# Altium schematic sheet Sheet2.SchDoc
size A3; SheetNumber: 1; SheetTotal: 1
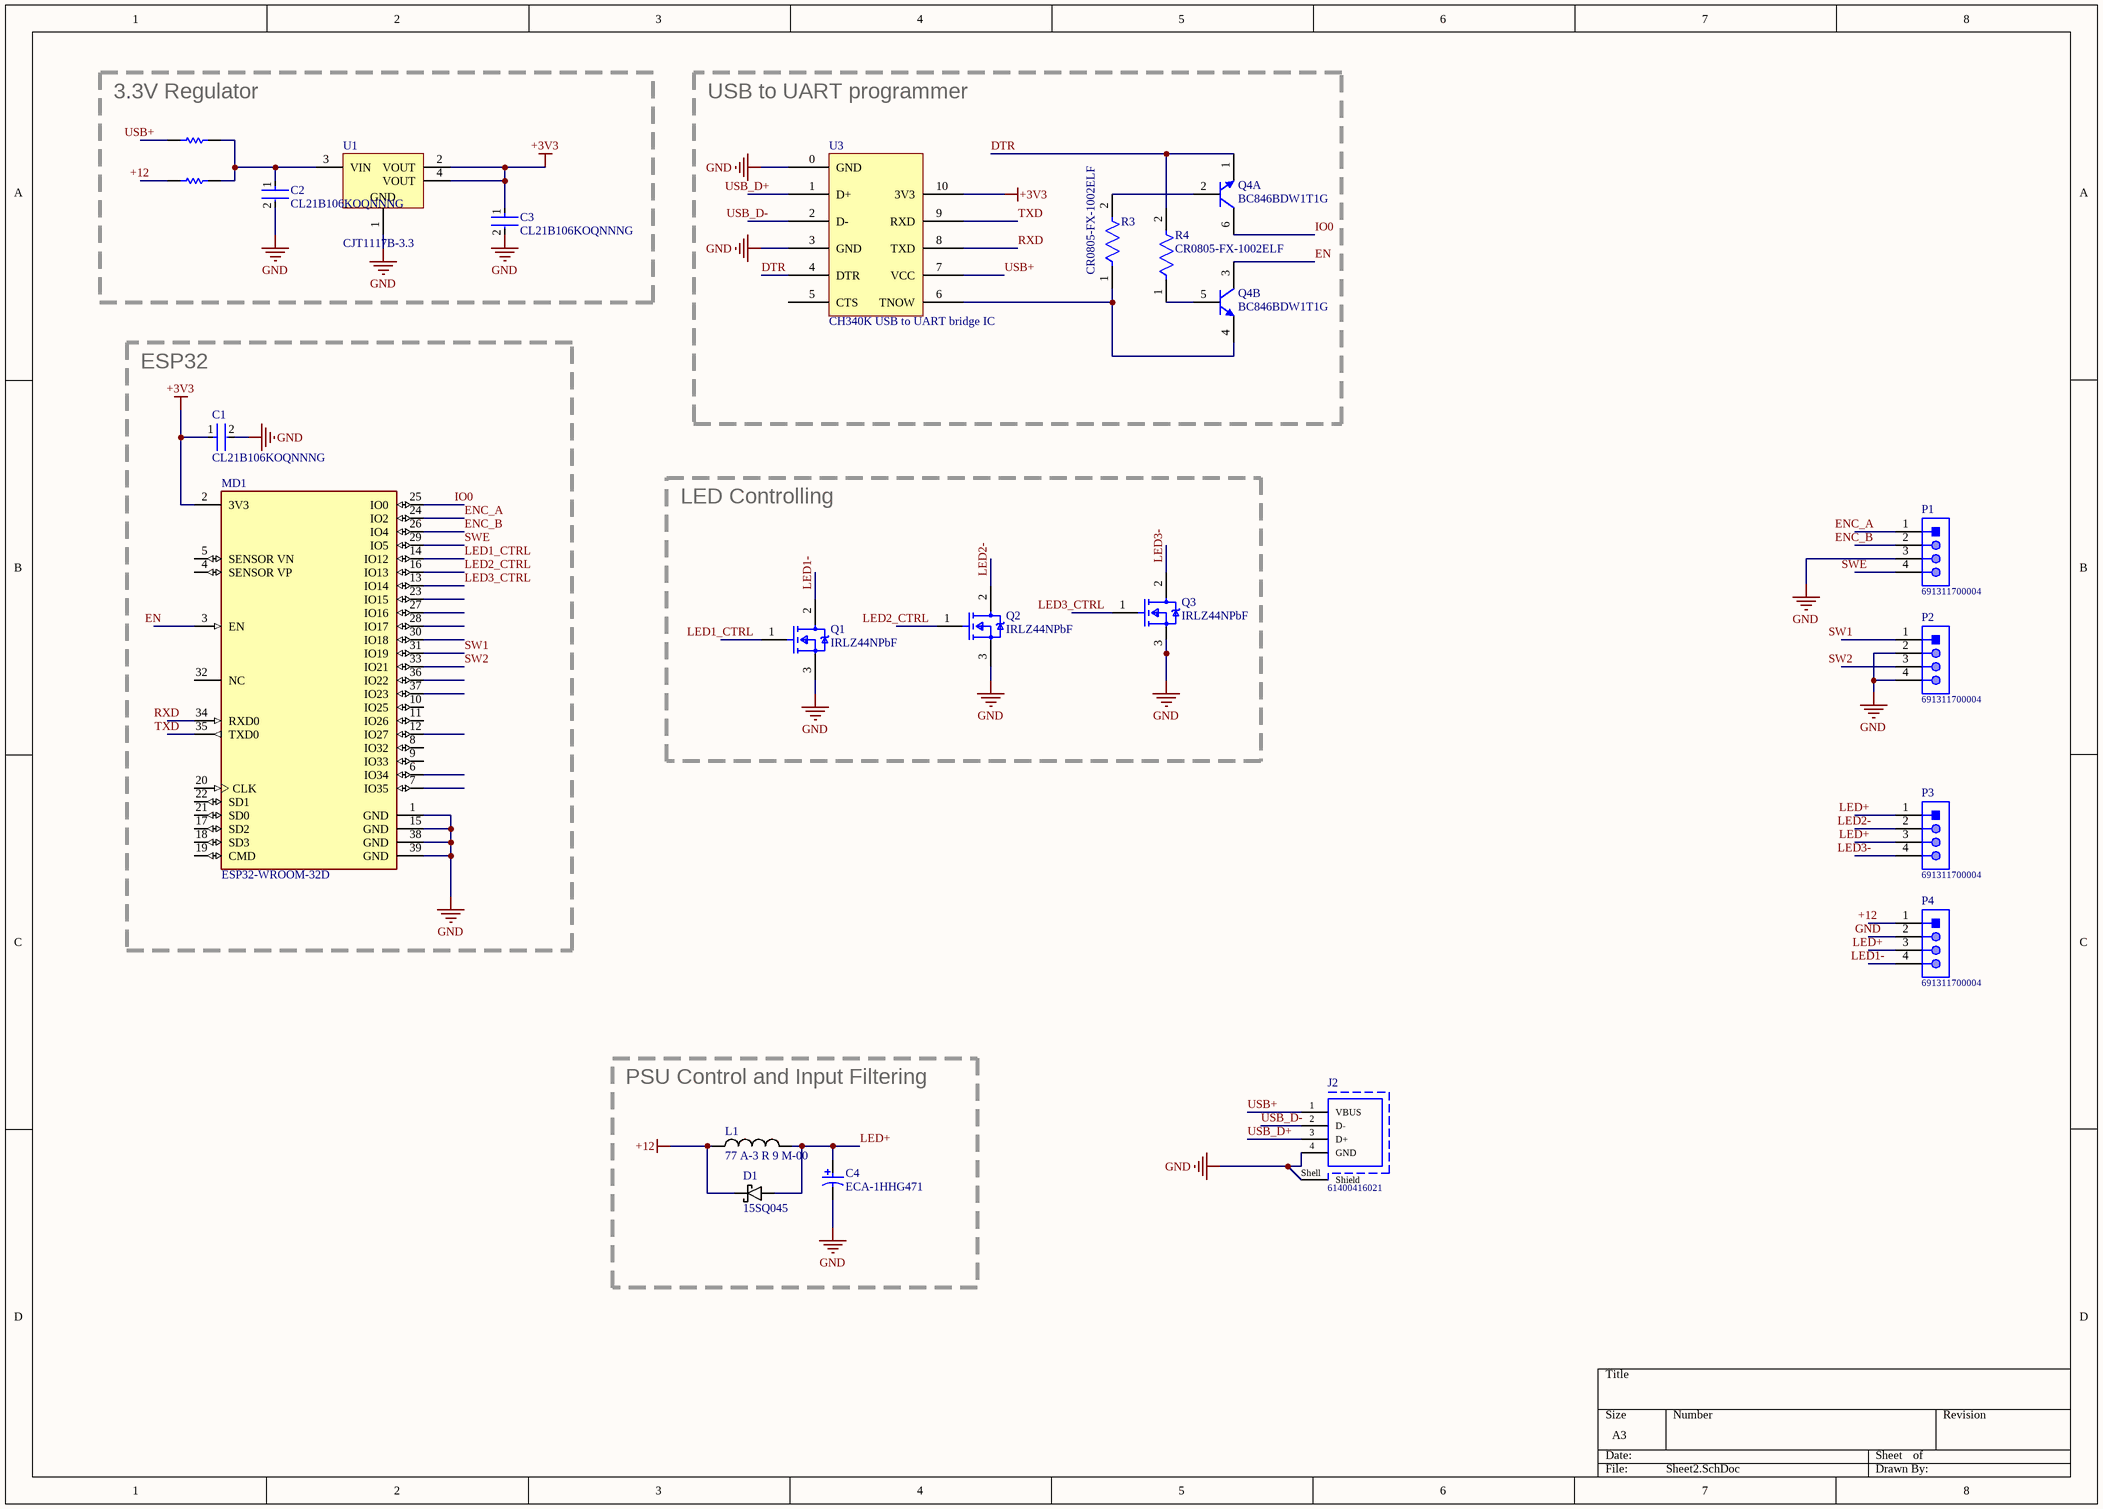
[diagram p0: Sheet2.SchDoc]

## Parts
C1  CL21B106KOQNNNG  [FP-CL21B106KOQNNNG-MFG]
C2  CL21B106KOQNNNG  [FP-CL21B106KOQNNNG-MFG]
C3  CL21B106KOQNNNG  [FP-CL21B106KOQNNNG-MFG]
C4  ECA-1HHG471  [PNSC-CAP-10x20-P2]
D1  15SQ045  [Shottky Diode]
J2  61400416021  [61400416021]
L1  77 A-3 R 9 M-00  [FIlter Inductor]
MD1  ESP32-WROOM-32D  [FP-ESP32-WROOM-32D-MFG]
P1  691311700004  [691311700004]
P2  691311700004  [691311700004]
P3  691311700004  [691311700004]
P4  691311700004  [691311700004]
Q1  IRLZ44NPbF  [FP-PG-TO220-3-MFG]
Q2  IRLZ44NPbF  [FP-PG-TO220-3-MFG]
Q3  IRLZ44NPbF  [FP-PG-TO220-3-MFG]
Q4  BC846BDW1T1G  [ONSC-SOT-363-6-419B-02_W_V]  (parts A,B of 2)
R1  RC0603JR-070RL  [RESC1608X55X25ML10T15]  (value not drawn)  (no BOM)
R2  RC0603JR-070RL  [RESC1608X55X25ML10T15]  (value not drawn)  (no BOM)
R3  CR0805-FX-1002ELF  [FP-CR0805-IPC_A]
R4  CR0805-FX-1002ELF  [FP-CR0805-IPC_A]
U1  CJT1117B-3.3  [DCY0004A_L]
U3  CH340K USB to UART bridge IC  [CH340K footprint]

## Blocks framed on the sheet
3.3V Regulator: C2 C3 R1 R2 U1
USB to UART programmer: Q4 R3 R4 U3
ESP32: C1 MD1
LED Controlling: Q1-Q3
PSU Control and Input Filtering: C4 D1 L1

## Nets
+3V3: C1.1 C3.1 MD1.2(3V3) U1.2(VOUT) U1.4(VOUT) U3.10(3V3)
+12: D1.2 L1.1 P4.1 R2.1
GND: C1.2 C2.2 C3.2 C4.2 J2.4(GND) J2.Shell(Shield) MD1.1(GND) MD1.15(GND) MD1.38(GND) MD1.39(GND) P1.3 P2.2 P2.4 P4.2 Q1.3(S) Q2.3(S) Q3.3(S) U1.1(GND) U3.0(GND) U3.3(GND)
DTR: Q4.1(E) R4.2 U3.4(DTR)
EN: MD1.3(EN) Q4.3(C)
ENC_A: MD1.24(IO2) P1.1
ENC_B: MD1.26(IO4) P1.2
IO0: MD1.25(IO0) Q4.6(C)
LED1-: P4.4 Q1.2(D)
LED1_CTRL: MD1.14(IO12) Q1.1(G)
LED2-: P3.2 Q2.2(D)
LED2_CTRL: MD1.16(IO13) Q2.1(G)
LED3-: P3.4 Q3.2(D)
LED3_CTRL: MD1.13(IO14) Q3.1(G)
LED+: C4.1 D1.1 L1.2 P3.1 P3.3 P4.3
RXD: MD1.34(RXD0) U3.8(TXD)
SW1: MD1.31(IO19) P2.1
SW2: MD1.33(IO21) P2.3
SWE: MD1.29(IO5) P1.4
TXD: MD1.35(TXD0) U3.9(RXD)
USB+: J2.1(VBUS) R1.1 U3.7(VCC)
USB_D+: J2.3(D+) U3.1(D+)
USB_D-: J2.2(D-) U3.2(D-)
NetC2_1: C2.1 R1.2 R2.2 U1.3(VIN)
NetQ4_2: Q4.2(B) R3.2
NetQ4_4: Q4.4(E) R3.1 U3.6(TNOW)
NetQ4_5: Q4.5(B) R4.1

Not connected (* = marked no-connect by the designer): MD1 4(SENSOR_VP) 5(SENSOR_VN) 6(IO34) 7(IO35) 8(IO32) 9(IO33) 10(IO25) 11(IO26) 12(IO27) 17(SD2) 18(SD3) 19(CMD) 20(CLK) 21(SD0) 22(SD1) 23(IO15) 27(IO16) 28(IO17) 30(IO18) 32(NC) 36(IO22) 37(IO23); U3 5(CTS)

## Library data of the parts
C1 = CMP-13271-000015-1: CAP CER 10UF 16V X7R 0805; Manufacturer: Samsung Electro-Mechanics; Temperature Coefficient: 15%; Tolerance: 10%; Capacitance: 100nF; Material: Ceramic; ComponentLink2URL: http://product.samsungsem.com/mlcc/CL21B106KOQNNN.do; Package: 0; Voltage Rating: 16V; Value: 10uF; Height: 1.4mm; Temperature Characteristic: X7R; Manufacturer Part Number: CL21B106KOQNNNG; Category: Cap; Lead Free: Yes; RoHS: TRUE; ComponentLink2Description: Datasheet; Octopart: https://octopart.com/cl21b106koqnnng-samsung-19995691; Device Class L1: Passive Components; Temperature Range Low: -55°C; Device Class L3: Ceramic Capacitors; Ipc Land Pattern Name: CAPC200125X125; Digikey Description: CAP CER 10UF 16V X7R 0805; Automotive: No; Temperature Range High: +125°C; Device Class L2: Capacitors; Temperature: -55°C to +125°C
C2 = CMP-13271-000015-1: CAP CER 10UF 16V X7R 0805; Manufacturer: Samsung Electro-Mechanics; Temperature Coefficient: 15%; Tolerance: 10%; Material: Ceramic; ComponentLink2URL: http://product.samsungsem.com/mlcc/CL21B106KOQNNN.do; Package: 0; Voltage Rating: 16V; Value: 10uF; Height: 1.4mm; Temperature Characteristic: X7R; Manufacturer Part Number: CL21B106KOQNNNG; Category: Cap; Lead Free: Yes; RoHS: TRUE; ComponentLink2Description: Datasheet; Octopart: https://octopart.com/cl21b106koqnnng-samsung-19995691; Device Class L1: Passive Components; Temperature Range Low: -55°C; Device Class L3: Ceramic Capacitors; Ipc Land Pattern Name: CAPC200125X125; Digikey Description: CAP CER 10UF 16V X7R 0805; Automotive: No; Capacitance: 10uF; Temperature Range High: +125°C; Device Class L2: Capacitors; Temperature: -55°C to +125°C
C3 = CMP-13271-000015-1: CAP CER 10UF 16V X7R 0805; Manufacturer: Samsung Electro-Mechanics; Temperature Coefficient: 15%; Value: 22uF; Tolerance: 10%; Material: Ceramic; ComponentLink2URL: http://product.samsungsem.com/mlcc/CL21B106KOQNNN.do; Package: 0; Voltage Rating: 16V; Height: 1.4mm; Temperature Characteristic: X7R; Manufacturer Part Number: CL21B106KOQNNNG; Category: Cap; Lead Free: Yes; RoHS: TRUE; ComponentLink2Description: Datasheet; Octopart: https://octopart.com/cl21b106koqnnng-samsung-19995691; Device Class L1: Passive Components; Temperature Range Low: -55°C; Device Class L3: Ceramic Capacitors; Ipc Land Pattern Name: CAPC200125X125; Digikey Description: CAP CER 10UF 16V X7R 0805; Automotive: No; Capacitance: 22uF; Temperature Range High: +125°C; Device Class L2: Capacitors; Temperature: -55°C to +125°C
C4 = CMP-2000-05308-1: Aluminum Electrolytic Capacitor, 470 uF, +/- 20%, 50 V, -55 to 105 degC, 2-Pin THD, RoHS, Bulk; Manufacturer: Panasonic; Package Version: Nov-12; Type: Radial; Lifetime@Temperature: 2000Hrs@105degC; Capacitance: 470µF; Rated Voltage: 50V; Ripple Current: 530mA; Case Size/Dimension: Ø10x20mm; Package Reference: CAP-10x20-P2; Package Description: 2-Pin Through Hole Device, Dia 10 mm, Body Length 20 mm, Pin Spacing 5 mm; Series: NHG; Datasheet Version: Nov-12; Datasheet URL: http://www.alliedelec.com/images/products/datasheets/bm/Panasonic/70067776.pdf; Package URL: http://www.alliedelec.com/images/products/datasheets/bm/Panasonic/70067776.pdf; Operating Temp-Max: 105degC; Operating Temp Range: -55to+105degC; Manufacturer URL: http://www.panasonic.com/
D1 = 15SQ045: Diotec 15SQ045; Voltage: 45V; Current: 15A
J2 = CMP-1502-03227-1: USB 2.0 Type A Receptacle WR-COM, Horizontal, THT; Manufacturer: Wurth Elektronik; Working Voltage: 30VAC; Rated Current: 1.5A; Contact Resistance: 20mOhm; Manufacturer URL: http://www.we-online.de; Publisher: WurthElektronik; Packaging: Tray; Operating Temperature: -40to105degC; Orientation: Horizontal; Mounting Technology: THT; Part Number: 61400416021; Gender: Receptacle; Package Reference: 61400416021; Connector Type: USB2.0TypeA; Datasheet URL: https://katalog.we-online.de/em/datasheet/61400416021.pdf
L1 = 77 A-3 R 9 M-00: Fastron 77 A-3 R 9 M-00; Inductance: 3.9uH; Max Current: 12A; Tolerance: +-20%
MD1 = CMP-194065-000003-1: WIFI MODULE 32MBITS SPI FLASH; Manufacturer: Espressif Systems; Max Supply Voltage: 3.6V; Nominal Supply Current: 500mA; Max Frequency: 2484MHz; Number Of Adc Channels: 16; Number Of Gpio: 32; Interface: I2C,SPI,UART,Ethernet,I2S,Other; Data Rate: 150Mbits/s; Min Supply Voltage: 3V; Bandwidth: 72MHz; Sensitivity: -98dBm; Octopart: https://octopart.com/esp32-wroom-32d-espressif+systems-91040050; Package: ESP32-WROOM-32D; ComponentLink2URL: https://www.espressif.com/sites/default/files/documentation/esp32-wroom-32d_esp32-wroom-32u_datasheet_en.pdf; Lead Free: Yes; Category: UNK; Mouser Description: Wi-Fi/BT BLE Module ESP32-D0WD, SPI Flash, UART, P; Device Class L1: Integrated Circuits (ICs); RoHS: TRUE; Temperature Range Low: -40°C; ComponentLink2Description: Datasheet; Digikey Description: WIFI MODULE 32MBITS SPI FLASH; Height: 3.2mm; Temperature: -40°C to +85°C; Manufacturer Part Number: ESP32-WROOM-32D; Device Class L3: Transceivers; Device Class L2: RF Semiconductors and Devices; Temperature Range High: +85°C; Automotive: No
P1-P4 = CMP-1502-02028-1: Serie 3117 - 5.00mm Open Vertical PCB Header WR-TBL, 4 pin, LCSC: DB128V-5.08-4P-GN-S; Manufacturer: Wurth Elektronik; Gender: Male; Pin Number: 4; Packaging: Box; Pitch: 5.00mm; Manufacturer URL: http://www.we-online.de; Publisher: WurthElektronik; Package Reference: 691311700004; Datasheet URL: http://katalog.we-online.de/em/datasheet/6913117000xx.pdf; Mounting Technology: THT; Operating Temperature: -40to105degC; Part Number: 691311700004
Q1-Q3 = CMP-32901-000488-1: MOSFET N-CH 55V 47A TO220AB; Turn-On Delay Time: 11ns; Gate to Source Voltage (Vgs): 16V; Element Configuration: Single; Rds On Max: 22mR; Turn-Off Delay Time: 26ns; Max Power Dissipation: 110W; Threshold Voltage: 2V; Drain to Source Resistance: 35mR; Input Capacitance: 1.7nF; Continuous Drain Current (ID): 47A; Case/Package: TO-220; Lead Free: Lead Free; Halogen Free: Halogen Free; Packaging: Rail/Tube; Length: 0.414inch; Min Operating Temperature: -55°C; REACH SVHC: No SVHC; Number of Pins: 3; Width: 0.185inch; Drain to Source Voltage (Vdss): 55V; Power Dissipation: 110W; RoHS Compliant: Yes; Max Operating Temperature: 175°C; Height: 0.6inch; Max Dual Supply Voltage: 55V; Drain to Source Breakdown Voltage: 55V; Mount: Through Hole
Q4 = CMP-1048-00850-1: Dual General Purpose Transistors, NPN, 6-Pin SOT-363, Pb-Free, Tape and Reel; Manufacturer: On Semiconductor; IC Continuous (A): 0.1; fT Min (MHz): 100; Polarity: Dual NPN; PartNumber: BC846BDW1T1G; ComponentLink3Description: Package Specification; PackageVersion: Rev. W, 01/2006; ComponentLink2URL: http://www.onsemi.cn/pub_link/Collateral/BC846BDW1T1-D.PDF; PackageDescription: 6-Pin Small Outline Transistor, Body 2 x 1.25 mm, Pitch 0.65 mm; ComponentLink2Description: Datasheet; PackageReference: SOT-363-6-419B-02_W; RoHS: TRUE; ComponentLink3URL: http://www.onsemi.com/pub_link/Collateral/NTJD4001N-D.PDF; DatasheetVersion: Rev. 9; ComponentLink1Description: Manufacturer URL; Mounting Technology: Surface Mount; Packing: Tape and Reel; ComponentLink1URL: http://www.onsemi.com/
R1 R2 = CMP-2100-03667-1: Chip Resistor, 0 Ohm, +/- 5%, 0.1 W, -55 to 155 degC, 0603 (1608 Metric), RoHS, Tape and Reel; Manufacturer: Yageo; Temperature Coefficient: 200ppm/degreesC; Voltage Rating: 50V; Power Rating: 100mW; Resistance: 0mOhm; Width: 0.8mm; Max Operating Temperature: 155degC; Tolerance: 5%; Package Reference: 0603; Height: 0.45mm; Depth: 0.8mm; Package Description: 2-Pin Surface Mount Device, Body 1.6 x 0.8 mm; Termination: SMD/SMT; Package Quantity: 5000; Case/Package: 0603; Case Code (Imperial): 0603; Radiation Hardening: No; Number of Pins: 2; Length: 1.6mm; Lead Free: LeadFree; Voltage Rating (DC): 50V; Military Standard: Not; Datasheet URL: http://www.yageo.com/NewPortal/yageodocoutput?fileName=/pdf/R-Chip/PYu-RC_Group_51_RoHS_L_5.pdf; Manufacturer URL: http://www.yageo.com/; Packaging: TapeandReel; Case Code (Metric): 1608; Min Operating Temperature: -55degC; Composition: ThickFilm; RoHSCompliant: true; Contact Plating: Tin; Datasheet Version: Rev. 5, 10/2016; REACH SVHC: NoSVHC
R3 R4 = CMP-07231-003204-1: Thick Film Chip Resistors 0805 10kΩ 0.125W 1% 100ppm/°C; Max Power Dissipation: 125mW; Voltage Rating: 150V; Voltage Rating (DC): 100V; Resistance: 10kR; Height: 0.5mm; Tolerance: 1%; Max Operating Temperature: 155°C; Thickness: 508um; Radiation Hardening: No; Packaging: Tape and Reel; Depth: 1.25mm; Contact Plating: Tin; Package Quantity: 1; Case Code (Metric): 2012; REACH SVHC: No SVHC; Min Operating Temperature: -55°C; Power Rating: 125mW; Mount: Surface Mount; Length: 2mm; Case Code (Imperial): 0805; Width: 1.25mm; Temperature Coefficient: 100ppm/°C; Termination: SMD/SMT; Composition: Thick Film; Features: Moisture Resistant; Case/Package: 0805; Number of Terminations: 2
U1 = CMP-0395-00527-2: 75dB@(120Hz) 1A 1.3V@(1A) Fixed 3.3V~3.3V Positive 1 15V SOT-223 Linear Voltage Regulators (LDO) ROHS; Iout(Max)(A): 0.8; Vin(Min)(V): 3.8; Eco-Plan: Green (RoHS & no Sb/Br); Rating: Catalog; Vout Adj(Max)(V): 2.8; Iq(Typ)(mA): 4; Fixed Output Options(V): 3.3; SubFamily: Single Channel LDO; Vdo(Typ)(mV): 1100; Vin(Max)(V): 15; PackageDescription: 4-Pin Plastic Small Outline, Body 3.5 x 6.5 mm, Pitch 2.3 mm; ComponentLink2Description: Datasheet; PackageReference: DCY0004A; ComponentLink1Description: Manufacturer URL; PackageVersion: 4202506/B; ComponentLink3Description: Package Specification; PartNumber: CJT1117B-3.3; Vout Adj(Min)(V): 2.8; ComponentLink2URL: https://datasheet.lcsc.com/lcsc/2108131530_Jiangsu-Changjing-Electronics-Technology-Co---Ltd--CJT1117B-3-3_C78777.pdf; ComponentLink1URL: http://www.ti.com/; Mounting Technology: Surface Mount; Code_JEDEC: TO-261; ComponentLink3URL: http://www.ti.com/litv/pdf/mpds094a; DatasheetVersion: SBVS001D
U3 = CH340K